# Altium schematic sheet Sheet1.SchDoc
size A4; SheetNumber: 1; SheetTotal: 1
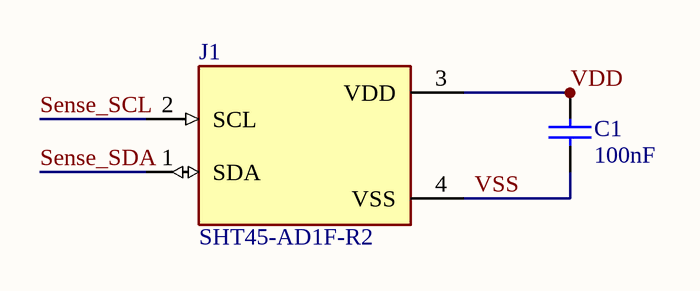
[diagram p0: Sheet1.SchDoc]

## Parts
C1  100nF  [CAPC1608X90X35ML10T15]
J1  SHT45-AD1F-R2  [SHT4X]

## Nets
Sense_SCL: J1.2(SCL)
Sense_SDA: J1.1(SDA)
VDD: C1.2 J1.3(VDD)
VSS: C1.1 J1.4(VSS)

## Library data of the parts
C1 = CMP-2100-03642-1: Chip Capacitor, 10 nF, +/- 10%, 50 V, -55 to 125 degC, 0603 (1608 Metric), RoHS, Tape and Reel; Manufacturer: Murata; Insulation Resistance: 10GR; Dielectric: X7R; Voltage Rating: 50V; Material: Ceramic; Package Quantity: 1; Lead Free: LeadFree; Case/Package: 0603; Termination: SMD/SMT; REACH SVHC: Unknown; Manufacturer URL: http://www.murata.com/; Datasheet URL: http://search.murata.co.jp/Ceramy/image/img/A01X/G101/ENG/GRM188R71H103KA01-01.pdf; Mount: SurfaceMount; Datasheet Version: 42401.0; Number of Pins: 2; Length: 1.6mm; Voltage: 50V; Depth: 0.8mm; Tolerance: 10%; Min Operating Temperature: -55degC; Voltage Rating (DC): 50V; Max Operating Temperature: 125degC; Package Description: 2-Pin Surface Mount Device, Body 1.6 x 0.8 mm; RoHSCompliant: True; Case Code (Imperial): 0603; Width: 0.031inch; Case Code (Metric): 1608; Height: 0.8mm; Package Reference: 0603; Packaging: TapeandReel; Thickness: 0.035inch; Capacitance: 100nF; Dielectric Material: Ceramic
J1 = SHT45-AD1F-R2: Digital Relative Humidity Temperature Sensor, Â±1.0 %RH, Â±0.1 Â°C, Ultra-Low-Power, with filtermembrane; MF: Sensirion; Price: None; Purchase-URL: https://pricing.snapeda.com/search/part/SHT45-AD1F-R2/?ref=eda; MP: SHT45-AD1F-R2; Check_prices: https://www.snapeda.com/parts/SHT45-AD1F-R2/Sensirion/view-part/?ref=eda; SnapEDA_Link: https://www.snapeda.com/parts/SHT45-AD1F-R2/Sensirion/view-part/?ref=snap; Availability: In Stock; Package: Package; Value: *